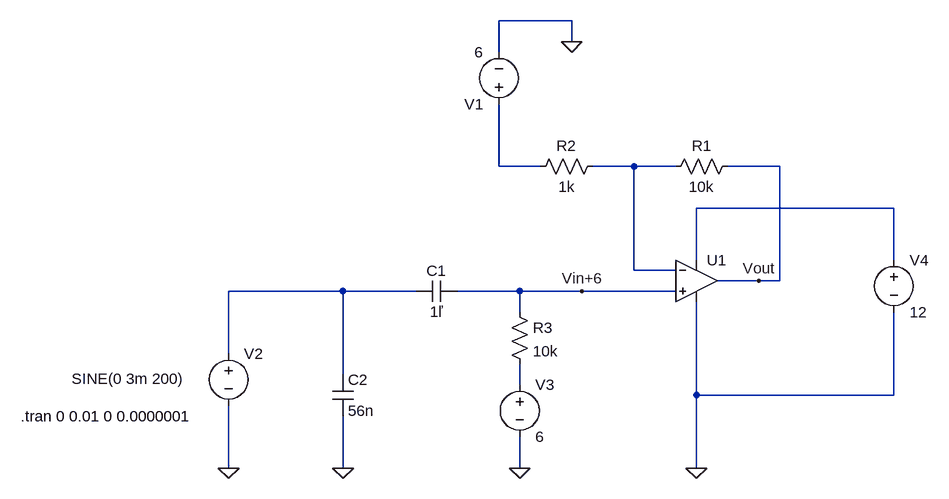
[diagram p0: schematic SP26_HookLineandTowfish_BufferOffsetSimulation_JamesBrasfield.asc]
SP26_HookLineandTowfish_BufferOffsetSimulation_JamesBrasfield.asc, the LTspice schematic file:
Version 4
SHEET 1 880 680
WIRE 0 -224 -112 -224
WIRE 0 -192 0 -224
WIRE -112 -176 -112 -224
WIRE -112 0 -112 -96
WIRE -48 0 -112 0
WIRE 96 0 32 0
WIRE 160 0 96 0
WIRE 320 0 240 0
WIRE 496 64 192 64
WIRE 192 144 192 64
WIRE 496 144 496 64
WIRE 96 160 96 0
WIRE 160 160 96 160
WIRE 288 176 224 176
WIRE 320 176 320 0
WIRE 320 176 288 176
WIRE -352 192 -528 192
WIRE -240 192 -352 192
WIRE -80 192 -176 192
WIRE 16 192 -80 192
WIRE 160 192 16 192
WIRE -80 224 -80 192
WIRE -528 288 -528 192
WIRE -352 320 -352 192
WIRE -80 336 -80 304
WIRE 192 352 192 208
WIRE 496 352 496 224
WIRE 496 352 192 352
WIRE -528 464 -528 368
WIRE -352 464 -352 384
WIRE -80 464 -80 416
WIRE 192 464 192 352
FLAG 0 -192 0
FLAG -80 464 0
FLAG -528 464 0
FLAG 192 464 0
FLAG 288 176 Vout
FLAG 16 192 Vin+6
FLAG -352 464 0
SYMBOL OpAmps\\UniversalOpAmp 192 176 R0
SYMATTR InstName U1
SYMBOL cap -176 176 R90
WINDOW 0 0 32 VBottom 2
WINDOW 3 32 32 VTop 2
SYMATTR InstName C1
SYMATTR Value 1ľ
SYMBOL voltage -112 -80 R180
WINDOW 123 0 0 Left 0
WINDOW 39 0 0 Left 0
SYMATTR InstName V1
SYMATTR Value 6
SYMBOL res 256 -16 R90
WINDOW 0 0 56 VBottom 2
WINDOW 3 32 56 VTop 2
SYMATTR InstName R1
SYMATTR Value 10k
SYMBOL res 48 -16 R90
WINDOW 0 0 56 VBottom 2
WINDOW 3 32 56 VTop 2
SYMATTR InstName R2
SYMATTR Value 1k
SYMBOL voltage -528 272 R0
WINDOW 3 -242 55 Left 2
WINDOW 123 0 0 Left 0
WINDOW 39 0 0 Left 0
SYMATTR Value SINE(0 3m 200)
SYMATTR InstName V2
SYMBOL voltage -80 320 R0
WINDOW 123 0 0 Left 0
WINDOW 39 0 0 Left 0
SYMATTR InstName V3
SYMATTR Value 6
SYMBOL res -96 208 R0
SYMATTR InstName R3
SYMATTR Value 10k
SYMBOL voltage 496 128 R0
WINDOW 123 0 0 Left 0
WINDOW 39 0 0 Left 0
SYMATTR InstName V4
SYMATTR Value 12
SYMBOL cap -368 320 R0
SYMATTR InstName C2
SYMATTR Value 56n
TEXT -848 384 Left 2 !.tran 0 0.01 0 0.0000001

The netlist it stands for:
* SP26_HookLineandTowfish_BufferOffsetSimulation_JamesBrasfield.asc
XU1 Vin+6 N002 N003 0 Vout level1 Avol=1Meg GBW=10Meg Vos=0 En=0 Enk=0 In=0 Ink=0 Rin=500Meg  ; pins In+ In- V+ V- OUT
C1 Vin+6 N004 1ľ
V1 N001 0 6
R1 Vout N002 10k
R2 N002 N001 1k
V2 N004 0 SINE(0 3m 200)
V3 N005 0 6
R3 Vin+6 N005 10k
V4 N003 0 12
C2 N004 0 56n
.tran 0 0.01 0 0.0000001
.lib UniversalOpAmp1.lib
.backanno
.end